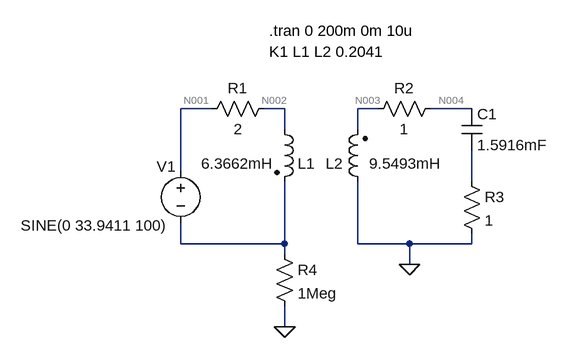
[diagram p0: schematic L5E1a.asc]
L5E1a.asc, the LTspice schematic file:
Version 4
SHEET 1 880 680
WIRE 16 32 -32 32
WIRE 128 32 96 32
WIRE 272 32 240 32
WIRE 416 32 352 32
WIRE 128 64 128 32
WIRE 240 64 240 32
WIRE -32 128 -32 32
WIRE 416 144 416 96
WIRE -32 240 -32 208
WIRE 128 240 128 144
WIRE 128 240 -32 240
WIRE 240 240 240 144
WIRE 320 240 240 240
WIRE 416 240 416 224
WIRE 416 240 320 240
WIRE 128 256 128 240
WIRE 320 272 320 240
WIRE 128 368 128 336
FLAG 128 368 0
FLAG 320 272 0
SYMBOL res 0 48 R270
WINDOW 0 32 56 VTop 2
WINDOW 3 0 56 VBottom 2
SYMATTR InstName R1
SYMATTR Value 2
SYMBOL res 368 16 R90
WINDOW 0 0 56 VBottom 2
WINDOW 3 32 56 VTop 2
SYMATTR InstName R2
SYMATTR Value 1
SYMBOL res 400 128 R0
SYMATTR InstName R3
SYMATTR Value 1
SYMBOL cap 400 32 R0
SYMATTR InstName C1
SYMATTR Value 1.5916mF
SYMBOL ind2 256 160 R180
WINDOW 0 38 44 Left 2
WINDOW 3 145 44 Left 2
SYMATTR InstName L2
SYMATTR Value 6.3662mH
SYMATTR Type ind
SYMBOL ind2 112 48 R0
WINDOW 0 36 68 Left 2
WINDOW 3 146 68 Left 2
SYMATTR InstName L1
SYMATTR Value 9.5493mH
SYMATTR Type ind
SYMBOL voltage -32 112 R0
WINDOW 0 -37 9 Left 2
WINDOW 3 -246 100 Left 2
WINDOW 123 0 0 Left 0
WINDOW 39 0 0 Left 0
SYMATTR InstName V1
SYMATTR Value SINE(0 33.9411 100)
SYMBOL res 112 240 R0
SYMATTR InstName R4
SYMATTR Value 1Meg
TEXT 104 -56 Left 2 !K1 L1 L2 0.2041
TEXT 104 -88 Left 2 !.tran 0 200m 0m 10u

The netlist it stands for:
* L5E1a.asc
R1 N001 N002 2
R2 N004 N003 1
R3 N005 0 1
C1 N004 N005 1.5916mF
L2 0 N003 6.3662mH
L1 N002 N006 9.5493mH
V1 N001 N006 SINE(0 33.9411 100)
R4 N006 0 1Meg
K1 L1 L2 0.2041
.tran 0 200m 0m 10u
.backanno
.end

* Results of the author's LTspice run, read from the files saved beside the schematic
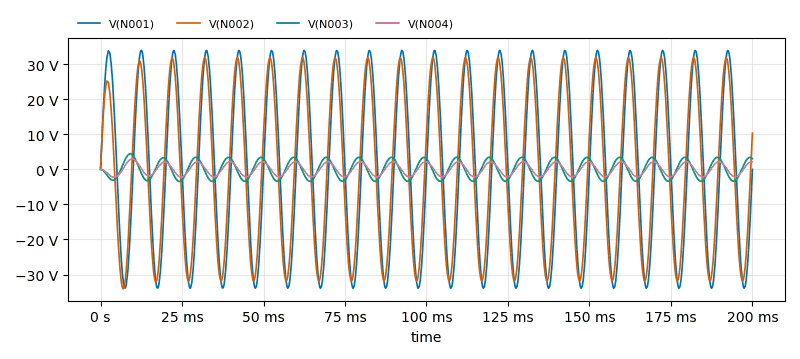
[diagram p1: Transient Analysis of L5E1a.asc, plotted from the saved traces]
* Transient Analysis, 1 run:
*   V(N001): min -33.93 V, max 33.94 V, average 1.056 mV, rms 23.98 V, last 0 V
*   V(N002): min -34.08 V, max 31.8 V, average -239 mV, rms 22.42 V, last 10.33 V
*   V(N003): min -3.47 V, max 4.434 V, average 12.38 mV, rms 2.426 V, last 3.029 V
*   V(N004): min -2.284 V, max 2.973 V, average 2.63 mV, rms 1.543 V, last 2.134 V